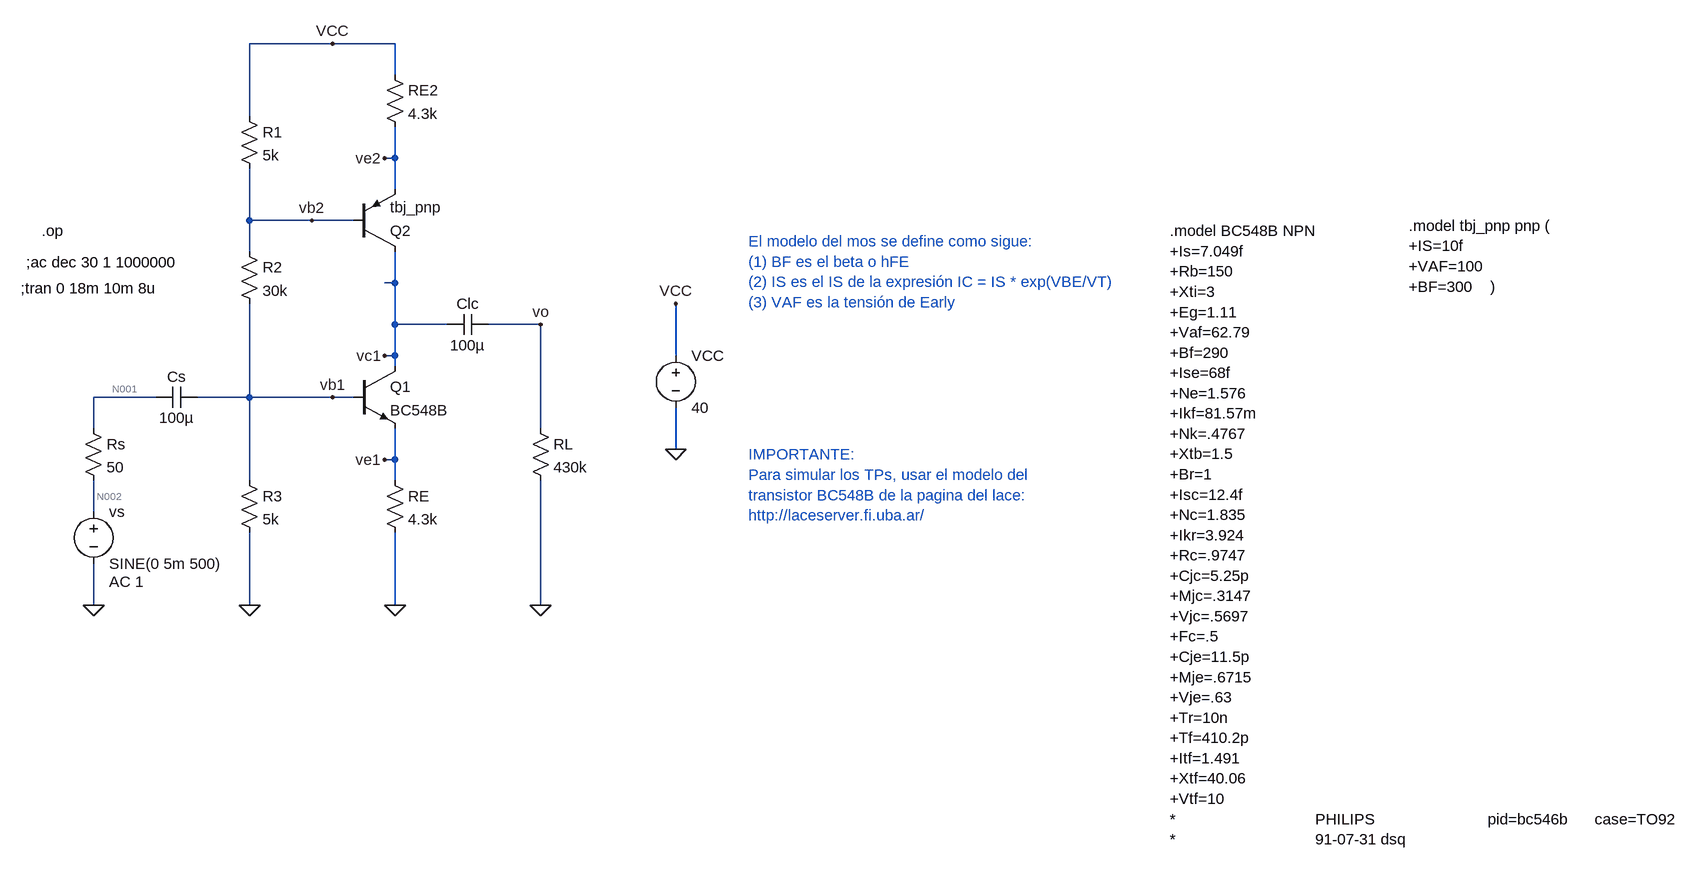
[diagram p0: schematic NPN.asc]
NPN.asc, the LTspice schematic file:
Version 4
SHEET 1 1900 872
WIRE -208 -448 -336 -448
WIRE -112 -448 -208 -448
WIRE -112 -400 -112 -448
WIRE -336 -336 -336 -448
WIRE -112 -272 -112 -320
WIRE -112 -272 -128 -272
WIRE -112 -224 -112 -272
WIRE -336 -176 -336 -256
WIRE -240 -176 -336 -176
WIRE -176 -176 -240 -176
WIRE -336 -128 -336 -176
WIRE -112 -80 -112 -128
WIRE -112 -80 -128 -80
WIRE -112 -16 -112 -80
WIRE -32 -16 -112 -16
WIRE 112 -16 32 -16
WIRE -112 32 -112 -16
WIRE -112 32 -128 32
WIRE 320 32 320 -48
WIRE -112 48 -112 32
WIRE -480 96 -576 96
WIRE -336 96 -336 -48
WIRE -336 96 -416 96
WIRE -208 96 -336 96
WIRE -176 96 -208 96
WIRE -576 144 -576 96
WIRE 112 144 112 -16
WIRE 320 176 320 112
WIRE -112 192 -112 144
WIRE -112 192 -128 192
WIRE -336 224 -336 96
WIRE -112 224 -112 192
WIRE -576 272 -576 224
WIRE -576 416 -576 352
WIRE -336 416 -336 304
WIRE -112 416 -112 304
WIRE 112 416 112 224
FLAG -208 96 vb1
FLAG -128 32 vc1
FLAG -128 192 ve1
FLAG -112 416 0
FLAG -336 416 0
FLAG 112 416 0
FLAG 320 176 0
FLAG 320 -48 VCC
FLAG -576 416 0
FLAG 112 -16 vo
FLAG -208 -448 VCC
FLAG -240 -176 vb2
FLAG -128 -272 ve2
SYMBOL npn -176 48 R0
SYMATTR InstName Q1
SYMATTR Value BC548B
SYMBOL res -128 208 R0
SYMATTR InstName RE
SYMATTR Value 4.3k
SYMBOL res -352 208 R0
SYMATTR InstName R3
SYMATTR Value 5k
SYMBOL res -352 -144 R0
SYMATTR InstName R2
SYMATTR Value 30k
SYMBOL cap 32 -32 R90
WINDOW 0 0 32 VBottom 2
WINDOW 3 32 32 VTop 2
SYMATTR InstName Clc
SYMATTR Value 100µ
SYMBOL res 96 128 R0
SYMATTR InstName RL
SYMATTR Value 430k
SYMBOL voltage 320 16 R0
WINDOW 123 0 0 Left 0
WINDOW 39 0 0 Left 0
SYMATTR InstName VCC
SYMATTR Value 40
SYMBOL cap -416 80 R90
WINDOW 0 0 32 VBottom 2
WINDOW 3 32 32 VTop 2
SYMATTR InstName Cs
SYMATTR Value 100µ
SYMBOL voltage -576 256 R0
WINDOW 123 24 124 Left 2
WINDOW 39 0 0 Left 0
SYMATTR Value2 AC 1
SYMATTR InstName vs
SYMATTR Value SINE(0 5m 500)
SYMBOL pnp -176 -128 M180
SYMATTR InstName Q2
SYMATTR Value tbj_pnp
SYMBOL res -352 -352 R0
SYMATTR InstName R1
SYMATTR Value 5k
SYMBOL res -128 -416 R0
SYMATTR InstName RE2
SYMATTR Value 4.3k
SYMBOL res -592 128 R0
SYMATTR InstName Rs
SYMATTR Value 50
TEXT 1080 -160 Left 2 !.model BC548B NPN\n+Is=7.049f\n+Rb=150\n+Xti=3\n+Eg=1.11\n+Vaf=62.79\n+Bf=290\n+Ise=68f\n+Ne=1.576\n+Ikf=81.57m\n+Nk=.4767\n+Xtb=1.5\n+Br=1\n+Isc=12.4f\n+Nc=1.835\n+Ikr=3.924\n+Rc=.9747\n+Cjc=5.25p\n+Mjc=.3147\n+Vjc=.5697\n+Fc=.5\n+Cje=11.5p\n+Mje=.6715\n+Vje=.63\n+Tr=10n\n+Tf=410.2p\n+Itf=1.491\n+Xtf=40.06\n+Vtf=10\n*                               PHILIPS                         pid=bc546b      case=TO92\n*                               91-07-31 dsq
TEXT 432 -144 Left 2 ;El modelo del mos se define como sigue:\n(1) BF es el beta o hFE\n(2) IS es el IS de la expresión IC = IS * exp(VBE/VT)\n(3) VAF es la tensión de Early
TEXT 432 184 Left 2 ;IMPORTANTE:\nPara simular los TPs, usar el modelo del \ntransistor BC548B de la pagina del lace:\nhttp://laceserver.fi.uba.ar/
TEXT -688 -72 Left 2 !;tran 0 18m 10m 8u
TEXT -680 -112 Left 2 !;ac dec 30 1 1000000
TEXT -656 -160 Left 2 !.op
TEXT 1448 -168 Left 2 !.model tbj_pnp pnp (\n+IS=10f\n+VAF=100\n+BF=300    )

The netlist it stands for:
* NPN.asc
Q1 vc1 vb1 ve1 0 BC548B
RE ve1 0 4.3k
R3 vb1 0 5k
R2 vb2 vb1 30k
Clc vo vc1 100µ
RL vo 0 430k
VCC VCC 0 40
Cs vb1 N001 100µ
vs N002 0 SINE(0 5m 500) AC 1
Q2 vc1 vb2 ve2 0 tbj_pnp
R1 VCC vb2 5k
RE2 VCC ve2 4.3k
Rs N001 N002 50
.model NPN NPN
.model PNP PNP
.lib standard.bjt
.model BC548B NPN
+Is=7.049f
+Rb=150
+Xti=3
+Eg=1.11
+Vaf=62.79
+Bf=290
+Ise=68f
+Ne=1.576
+Ikf=81.57m
+Nk=.4767
+Xtb=1.5
+Br=1
+Isc=12.4f
+Nc=1.835
+Ikr=3.924
+Rc=.9747
+Cjc=5.25p
+Mjc=.3147
+Vjc=.5697
+Fc=.5
+Cje=11.5p
+Mje=.6715
+Vje=.63
+Tr=10n
+Tf=410.2p
+Itf=1.491
+Xtf=40.06
+Vtf=10
*                               PHILIPS                         pid=bc546b      case=TO92
*                               91-07-31 dsq
* El modelo del mos se define como sigue:
* (1) BF es el beta o hFE
* (2) IS es el IS de la expresión IC = IS * exp(VBE/VT)
* (3) VAF es la tensión de Early
* IMPORTANTE:
* Para simular los TPs, usar el modelo del
* transistor BC548B de la pagina del lace:
* http://laceserver.fi.uba.ar/
;tran 0 18m 10m 8u
;ac dec 30 1 1000000
.op
.model tbj_pnp pnp (
+IS=10f
+VAF=100
+BF=300    )
.backanno
.end

* Results of the author's LTspice run, read from the files saved beside the schematic
* Operating Point:
*   V(vc1) = 31.79 V
*   V(vb1) = 4.988 V
*   V(ve1) = 4.333 V
*   V(vb2) = 35.01 V
*   V(vo) = 1.367 nV
*   V(vcc) = 40 V
*   V(n001) = 24.94 fV
*   V(n002) = 0 V
*   V(ve2) = 35.67 V
*   Ic(Q2) = -1.005 mA
*   Ib(Q2) = -3.244 µA
*   Ie(Q2) = 1.008 mA
*   Ic(Q1) = 1.005 mA
*   Ib(Q1) = 3.099 µA
*   Ie(Q1) = -1.008 mA
*   I(Cs) = 0 A
*   I(Clc) = -3.179 fA
*   I(Rs) = 0 A
*   I(Re2) = 1.008 mA
*   I(R1) = 997.5 µA
*   I(Rl) = 3.179 fA
*   I(R2) = 1.001 mA
*   I(R3) = 997.7 µA
*   I(Re) = 1.008 mA
*   I(Vs) = 0 A
*   I(Vcc) = -2.005 mA
* From the log:
*   Semiconductor Device Operating Points:
*                           --- Bipolar Transistors ---
*   Name:       q2          q1
*   Model:    tbj_pnp     bc548b
*   Ib:      -3.24e-06    3.10e-06
*   Ic:      -1.00e-03    1.00e-03
*   Vbe:     -6.54e-01    6.56e-01
*   Vbc:      3.22e+00   -2.68e+01
*   Vce:     -3.87e+00    2.75e+01
*   BetaDC:   3.10e+02    3.24e+02
*   Gm:       3.88e-02    3.85e-02
*   Rpi:      7.97e+03    9.04e+03
*   Rx:       0.00e+00    1.50e+02
*   Ro:       1.03e+05    8.92e+04
*   Cbe:      0.00e+00    4.74e-11
*   Cbc:      0.00e+00    1.55e-12
*   Cjs:      0.00e+00    0.00e+00
*   BetaAC:   3.10e+02    3.48e+02
*   Cbx:      0.00e+00    0.00e+00
*   Ft:       0.00e+00    1.25e+08